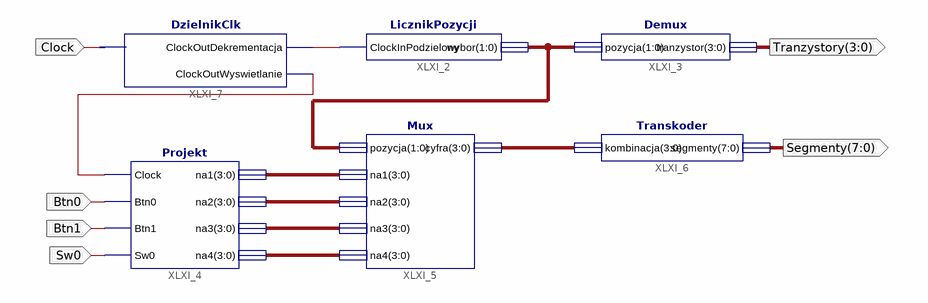
[diagram p0: schematic sheet 1]
// Xilinx ISE schematic SchematProjektu.sch (xbr) as structural Verilog: 6 symbols, 6 ports
module SchematProjektu (
  input  Clock,
  input  Btn0,
  input  Btn1,
  input  Sw0,
  output [3:0] Tranzystory,
  output [7:0] Segmenty
);

  wire XLXN_25, XLXN_28;
  wire [1:0] XLXN_17;
  wire [3:0] XLXN_20, XLXN_21, XLXN_22, XLXN_23, XLXN_24;

  LicznikPozycji XLXI_2 (.ClockInPodzielony(XLXN_28), .wybor(XLXN_17));
  Demux XLXI_3 (.pozycja(XLXN_17), .tranzystor(Tranzystory));
  Projekt XLXI_4 (
    .Clock(XLXN_25), .Btn0(Btn0), .Btn1(Btn1), .Sw0(Sw0), .na1(XLXN_21), .na2(XLXN_22), .na3(XLXN_23),
    .na4(XLXN_24));
  Mux XLXI_5 (.pozycja(XLXN_17), .na1(XLXN_21), .na2(XLXN_22), .na3(XLXN_23), .na4(XLXN_24), .cyfra(XLXN_20));
  Transkoder XLXI_6 (.kombinacja(XLXN_20), .segmenty(Segmenty));
  DzielnikClk XLXI_7 (.ClockIn(Clock), .ClockOutDekrementacja(XLXN_28), .ClockOutWyswietlanie(XLXN_25));
endmodule
